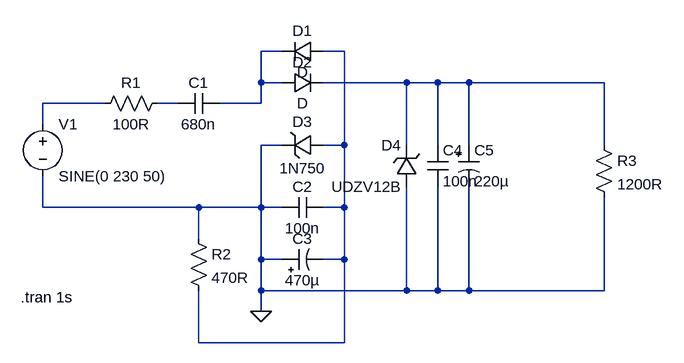
[diagram p0: schematic Draft1.asc]
Draft1.asc, the LTspice schematic file:
Version 4
SHEET 1 1052 680
WIRE 336 48 304 48
WIRE 432 48 400 48
WIRE 304 96 304 48
WIRE 336 96 304 96
WIRE 528 96 400 96
WIRE 576 96 528 96
WIRE 624 96 576 96
WIRE 832 96 624 96
WIRE 64 128 -32 128
WIRE 176 128 144 128
WIRE 304 128 304 96
WIRE 304 128 240 128
WIRE -32 160 -32 128
WIRE 336 192 304 192
WIRE 432 192 432 48
WIRE 432 192 400 192
WIRE 528 192 528 96
WIRE 576 192 576 96
WIRE 624 192 624 96
WIRE 832 192 832 96
WIRE -32 288 -32 240
WIRE 208 288 -32 288
WIRE 304 288 304 192
WIRE 304 288 208 288
WIRE 336 288 304 288
WIRE 432 288 432 192
WIRE 432 288 400 288
WIRE 208 336 208 288
WIRE 304 368 304 288
WIRE 336 368 304 368
WIRE 432 368 432 288
WIRE 432 368 400 368
WIRE 304 416 304 368
WIRE 528 416 528 256
WIRE 528 416 304 416
WIRE 576 416 576 256
WIRE 576 416 528 416
WIRE 624 416 624 256
WIRE 624 416 576 416
WIRE 832 416 832 272
WIRE 832 416 624 416
WIRE 304 448 304 416
WIRE 208 496 208 416
WIRE 432 496 432 368
WIRE 432 496 208 496
FLAG 304 448 0
SYMBOL res 160 112 R90
WINDOW 0 0 56 VBottom 2
WINDOW 3 32 56 VTop 2
SYMATTR InstName R1
SYMATTR Value 100R
SYMBOL cap 240 112 R90
WINDOW 0 0 32 VBottom 2
WINDOW 3 32 32 VTop 2
SYMATTR InstName C1
SYMATTR Value 680n
SYMBOL diode 400 32 R90
WINDOW 0 0 32 VBottom 2
WINDOW 3 32 32 VTop 2
SYMATTR InstName D1
SYMBOL diode 336 112 R270
WINDOW 0 32 32 VTop 2
WINDOW 3 0 32 VBottom 2
SYMATTR InstName D2
SYMBOL cap 400 272 R90
WINDOW 0 0 32 VBottom 2
WINDOW 3 32 32 VTop 2
SYMATTR InstName C2
SYMATTR Value 100n
SYMBOL polcap 336 384 R270
WINDOW 0 32 32 VTop 2
WINDOW 3 0 32 VBottom 2
SYMATTR InstName C3
SYMATTR Value 470µ
SYMBOL cap 560 192 R0
SYMATTR InstName C4
SYMATTR Value 100n
SYMBOL polcap 608 192 R0
SYMATTR InstName C5
SYMATTR Value 220µ
SYMBOL voltage -32 144 R0
WINDOW 123 0 0 Left 2
WINDOW 39 0 0 Left 2
SYMATTR InstName V1
SYMATTR Value SINE(0 230 50)
SYMBOL zener 400 176 R90
WINDOW 0 -4 32 VBottom 2
WINDOW 3 36 32 VTop 2
SYMATTR InstName D3
SYMATTR Value 1N750
SYMBOL zener 544 256 R180
WINDOW 0 24 64 Left 2
WINDOW 3 24 0 Left 2
SYMATTR InstName D4
SYMATTR Value UDZV12B
SYMBOL res 192 320 R0
SYMATTR InstName R2
SYMATTR Value 470R
SYMBOL res 816 176 R0
SYMATTR InstName R3
SYMATTR Value 1200R
TEXT -66 426 Left 2 !.tran 1s

The netlist it stands for:
* Draft1.asc
R1 N005 N004 100R
C1 N001 N005 680n
D1 N002 N001 D
D2 N001 N003 D
C2 N002 0 100n
C3 0 N002 470µ
C4 N003 0 100n
C5 N003 0 220µ
V1 N004 0 SINE(0 230 50)
D3 N002 0 1N750
D4 0 N003 UDZV12B
R2 0 N002 470R
R3 N003 0 1200R
.model D D
.lib standard.dio
.tran 1s
.backanno
.end